# EAGLE board Lafferty1ab (EAGLE 6.6.0), part 1 of 3
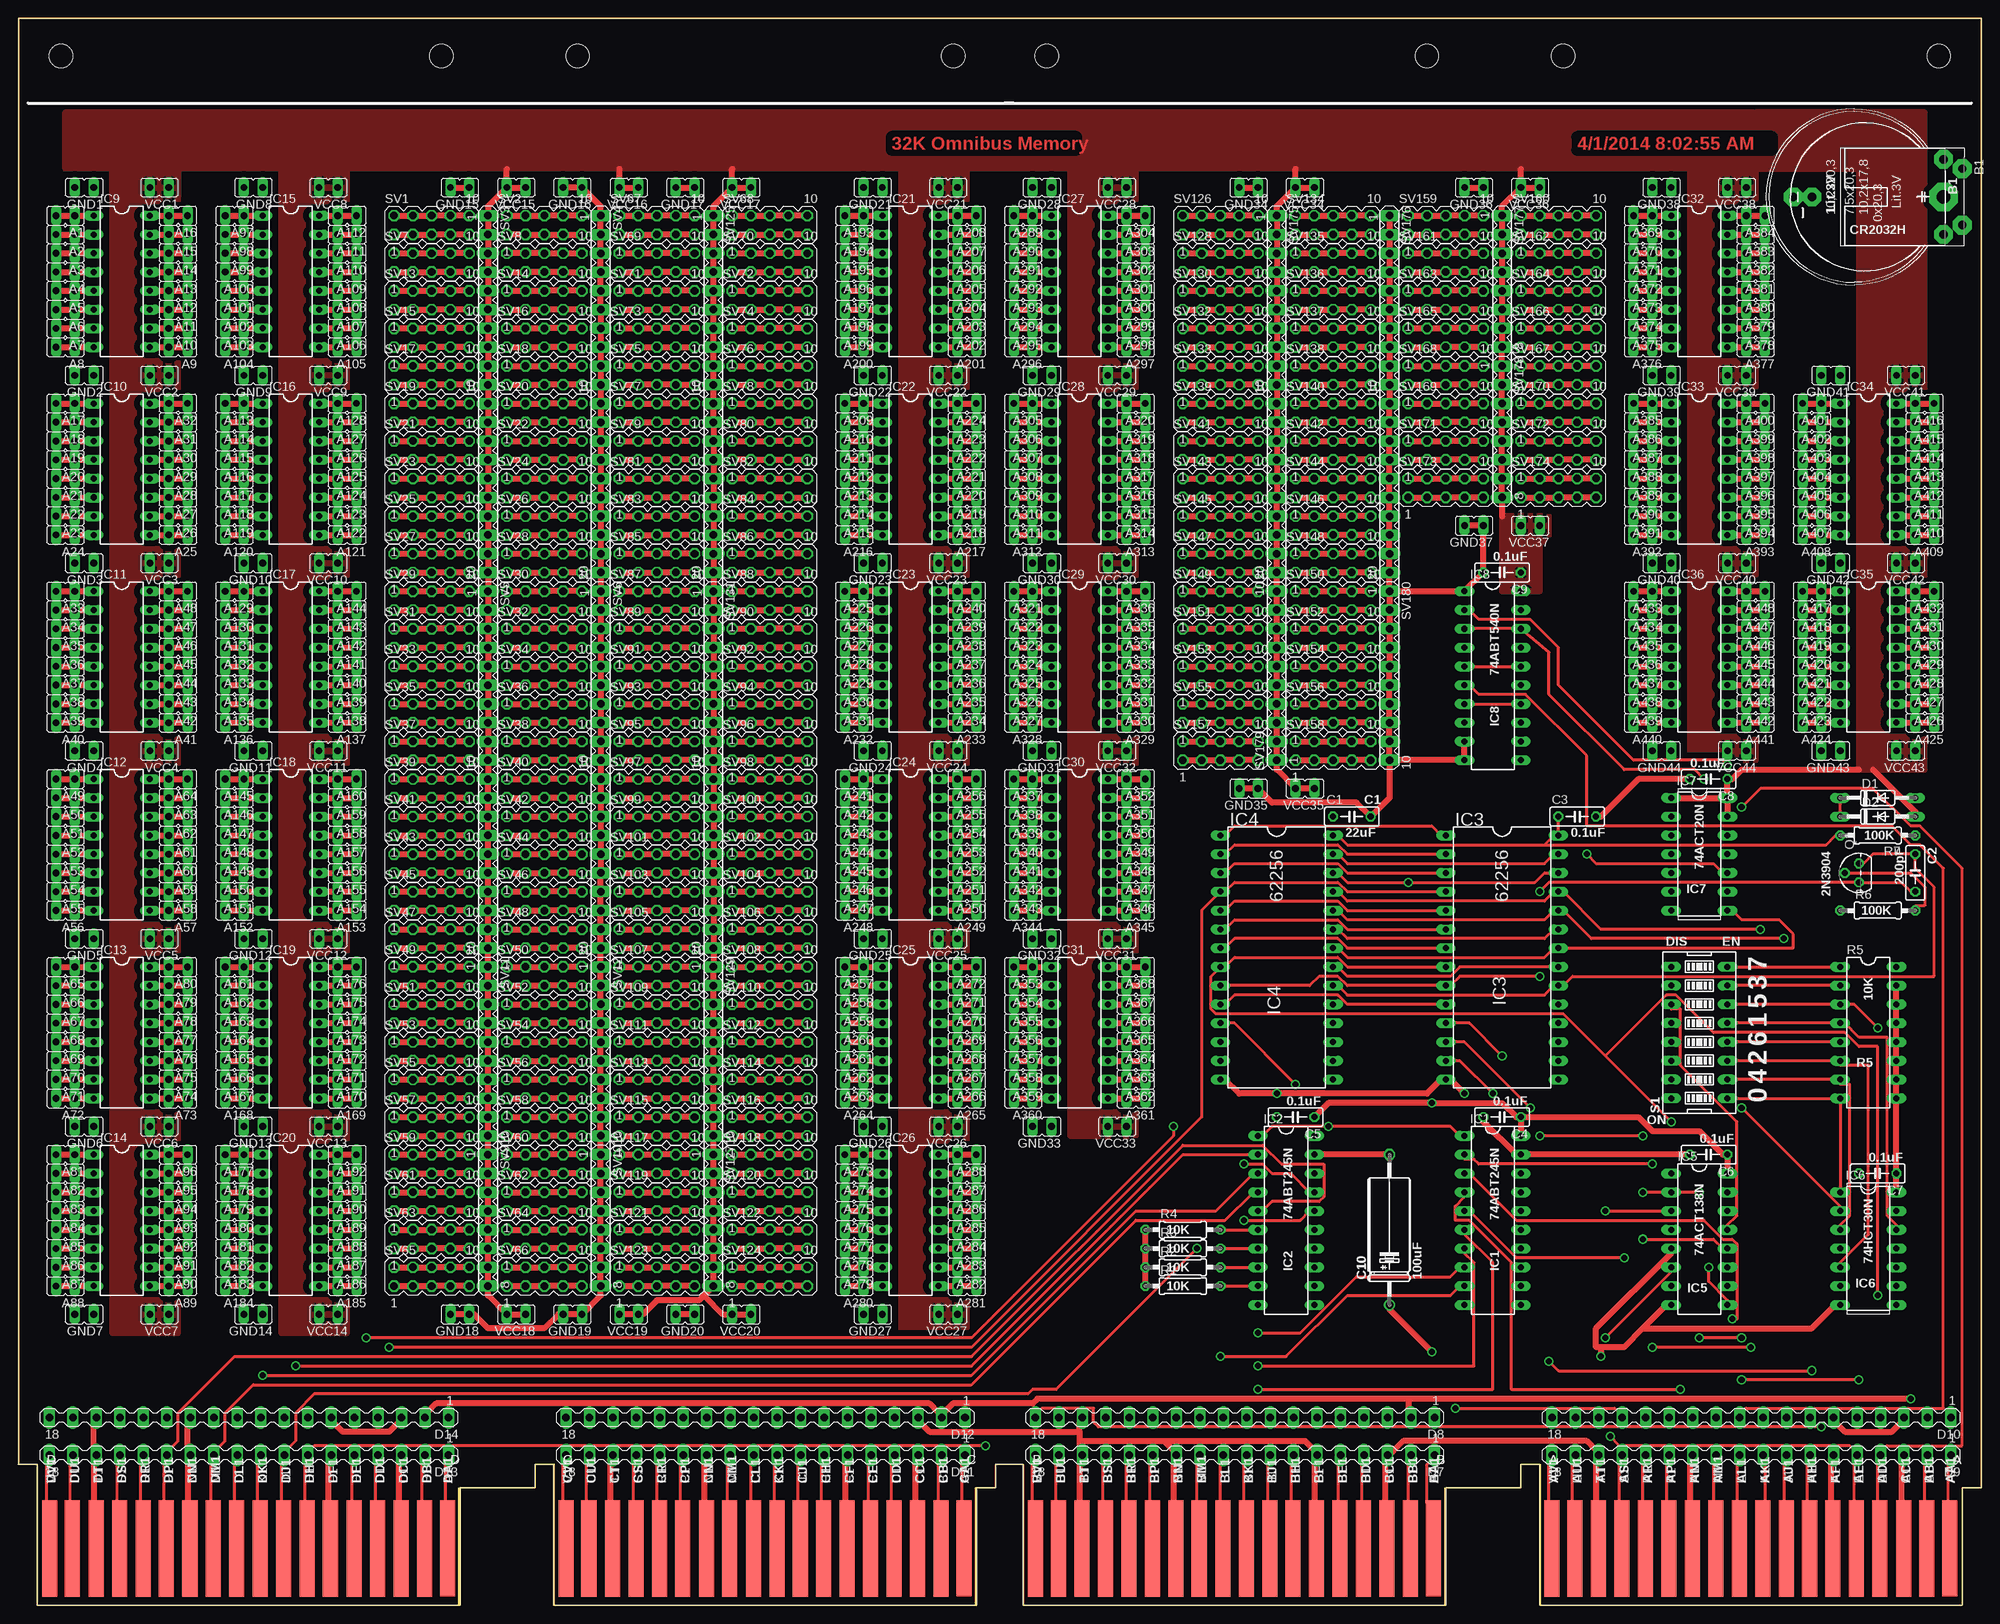
[diagram p5: board, top side]
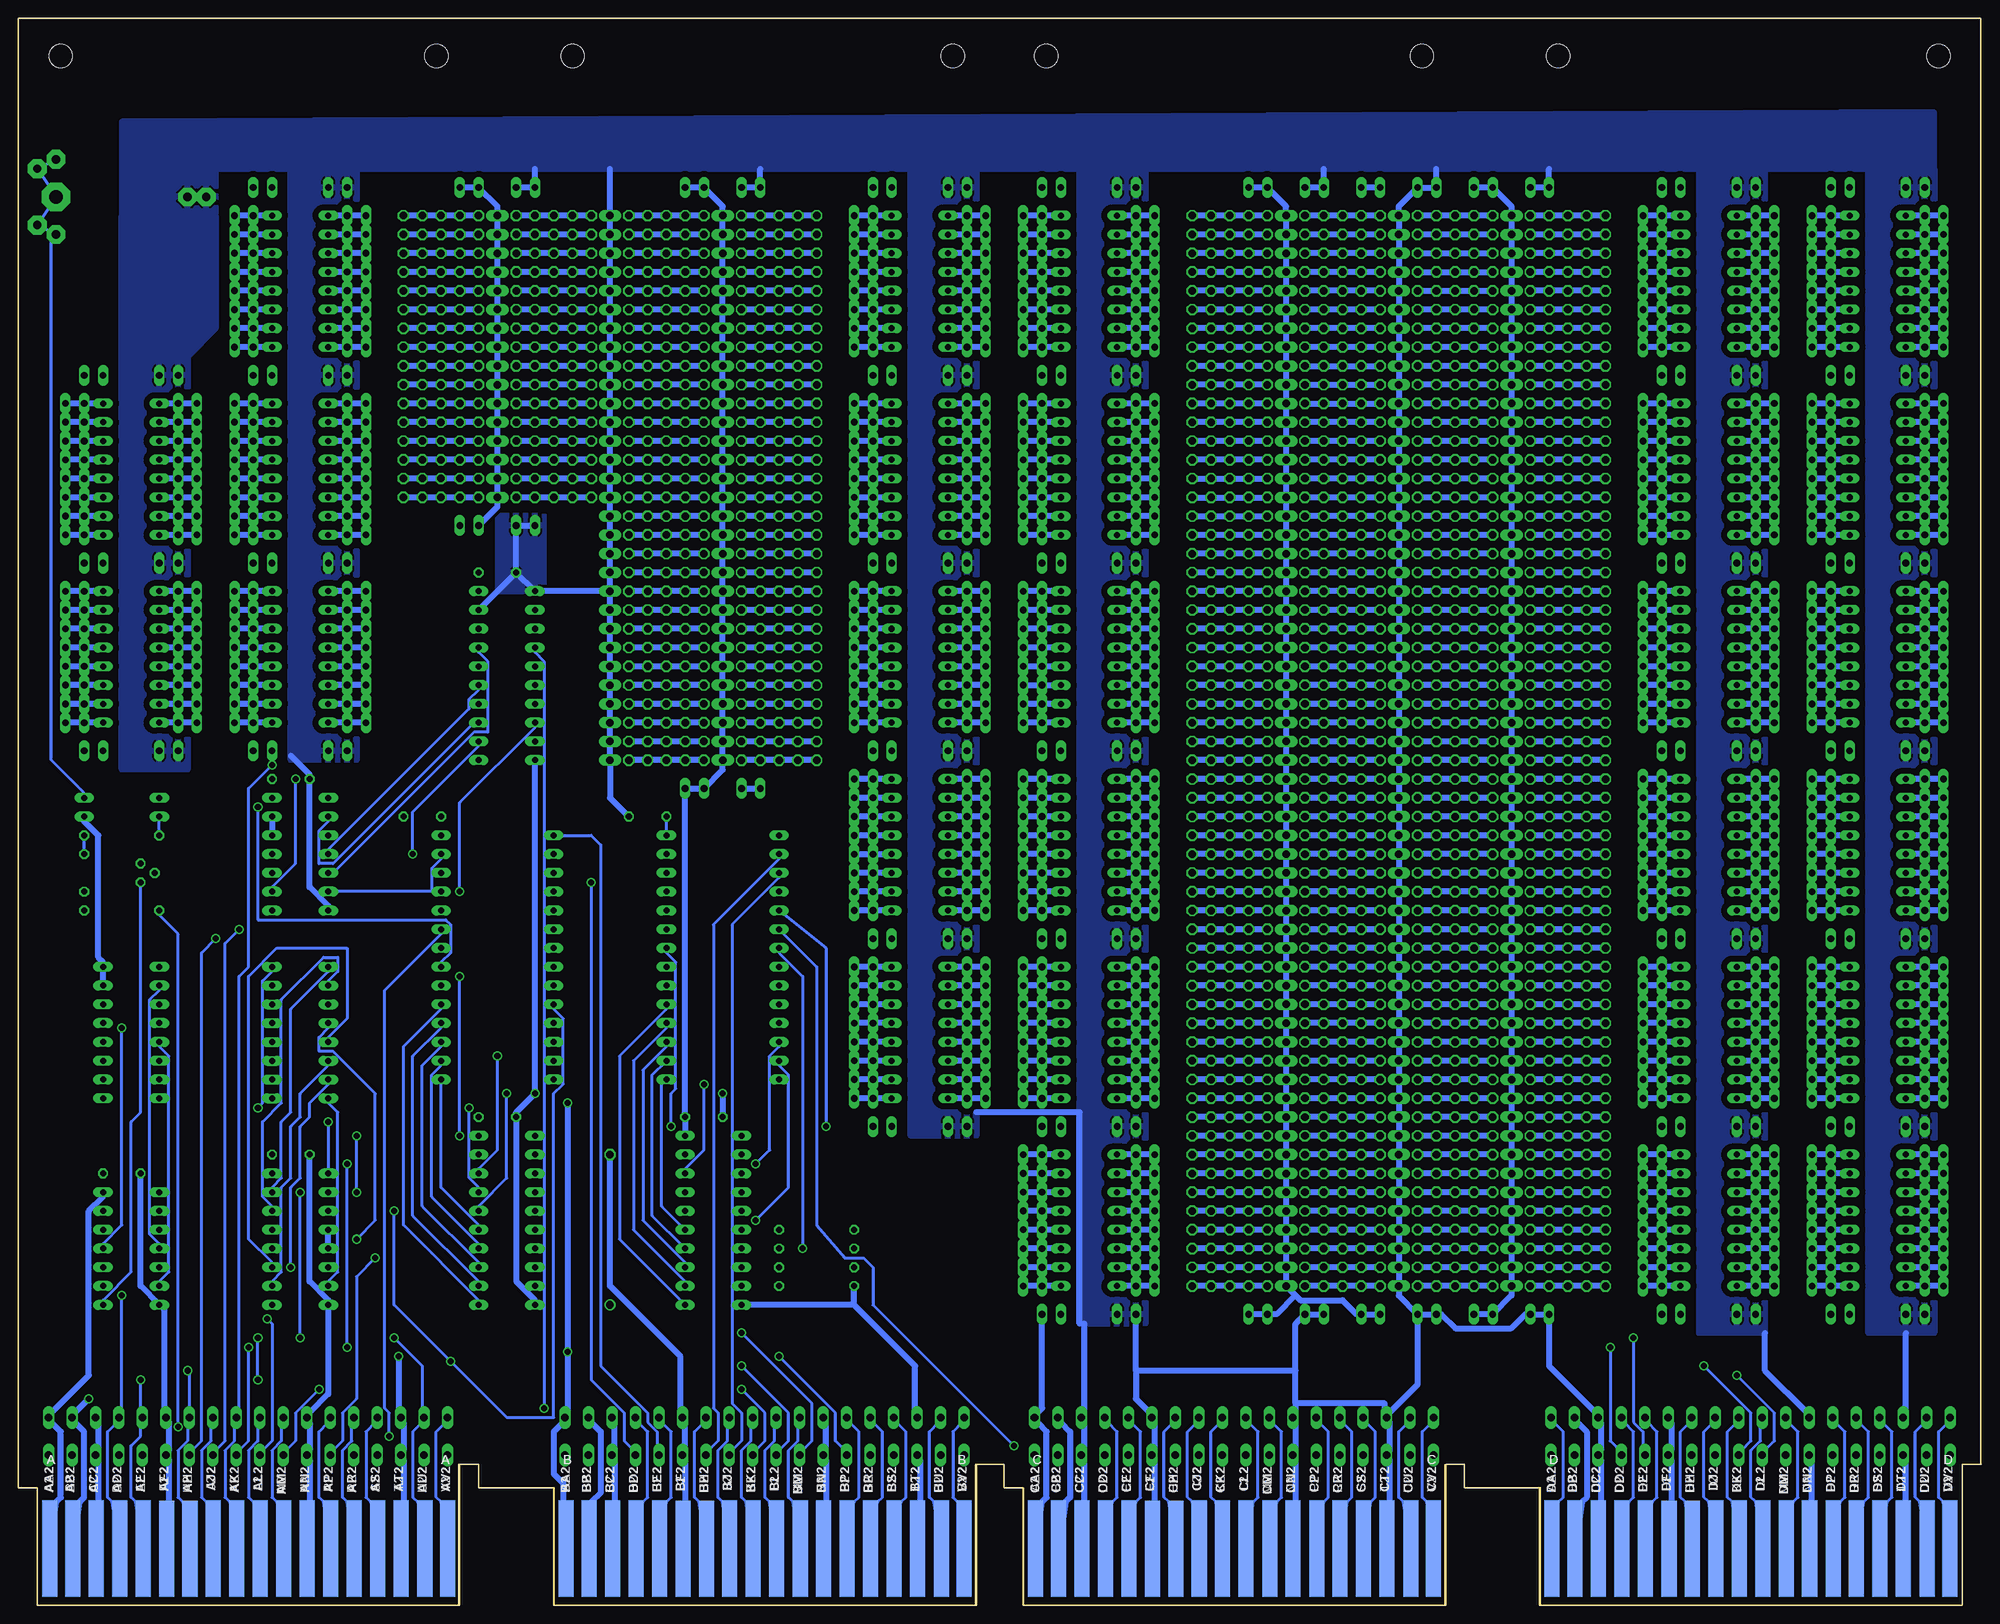
[diagram p6: board, bottom side, seen from below]

Size 265.43 x 214.63 mm. Coordinates in mm from the lower left corner, seen from the top.
Outline: 136.02,0 136.02,19.05 135.83,19.05
Outline: 129.41,0 129.41,15.88 129.6,15.88
Outline: 192.91,0 192.91,15.88 193.04,15.88
Outline: 205.87,0 205.87,19.05 205.74,19.05
Outline: 59.56,0 59.56,15.88 59.75,15.88
Outline: 72.52,0 72.52,19.05 72.39,19.05
Copper layers (1+16): Top 0.035mm / dielectric 1.5mm / Bottom 0.035mm
Design rules "16mils": minimum track width 16mil, minimum drill 32mil, track to track 15mil, track to pad 10mil, pad to pad 10mil, via to via 10mil, smd to smd 10mil, copper to edge 13mil, drill to drill 10mil, minimum pad ring 10mil, minimum via ring 8mil, stop-mask expansion 0mil, vias tented up to drill 0mil, thermal gap 10mil
Net classes: 1 supply: width 0.813 mm

## Footprints (pad centres in the part's own frame; a part is rotated, then mirrored left to right if it is on the bottom)
JP1 = drill 0.914 long: 1 0,-1.27; 2 0,1.27
B2430UNI = drill 1.118 pad 2.54 octagon: + 3.81,14.605; +@1 -3.81,14.605; +@2 -5.08,12.065; +@3 5.08,12.065; - 0,-5.715; -@1 0,-8.255 | drill 1.803 pad 3.81 octagon: +@4 0,12.065
C050-025X075 = drill 0.813 octagon: 1 -2.54,0; 2 2.54,0
E12-8 = drill 1.016: + -10.16,0 | drill 1.016 octagon: - 10.16,0
DO35-10 = drill 0.813 long: A 5.08,0; C -5.08,0
MA18-1 = drill 1.016 long: 1 -25.146,0; 2 -21.971,0; 3 -18.796,0; 4 -15.621,0; 5 -12.446,0; 6 -9.271,0; 7 -6.096,0; 8 -2.921,0; 9 0.254,0; 10 3.429,0; 11 6.604,0; 12 9.779,0; 13 12.954,0; 14 16.129,0; 15 19.304,0; 16 22.479,0; 17 25.654,0; 18 28.829,0
DIL20 = drill 0.813 long: 1 -11.43,-3.81; 2 -8.89,-3.81; 3 -6.35,-3.81; 4 -3.81,-3.81; 5 -1.27,-3.81; 6 1.27,-3.81; 7 3.81,-3.81; 8 6.35,-3.81; 9 8.89,-3.81; 10 11.43,-3.81; 11 11.43,3.81; 12 8.89,3.81; 13 6.35,3.81; 14 3.81,3.81; 15 1.27,3.81; 16 -1.27,3.81; 17 -3.81,3.81; 18 -6.35,3.81; 19 -8.89,3.81; 20 -11.43,3.81
DIL28-6 = drill 0.813 long: 1 -16.51,-7.62; 2 -13.97,-7.62; 3 -11.43,-7.62; 4 -8.89,-7.62; 5 -6.35,-7.62; 6 -3.81,-7.62; 7 -1.27,-7.62; 8 1.27,-7.62; 9 3.81,-7.62; 10 6.35,-7.62; 11 8.89,-7.62; 12 11.43,-7.62; 13 13.97,-7.62; 14 16.51,-7.62; 15 16.51,7.62; 16 13.97,7.62; 17 11.43,7.62; 18 8.89,7.62; 19 6.35,7.62; 20 3.81,7.62; 21 1.27,7.62; 22 -1.27,7.62; 23 -3.81,7.62; 24 -6.35,7.62; 25 -8.89,7.62; 26 -11.43,7.62; 27 -13.97,7.62; 28 -16.51,7.62
DIL16 = drill 0.813 long: 1 -8.89,-3.81; 2 -6.35,-3.81; 3 -3.81,-3.81; 4 -1.27,-3.81; 5 1.27,-3.81; 6 3.81,-3.81; 7 6.35,-3.81; 8 8.89,-3.81; 9 8.89,3.81; 10 6.35,3.81; 11 3.81,3.81; 12 1.27,3.81; 13 -1.27,3.81; 14 -3.81,3.81; 15 -6.35,3.81; 16 -8.89,3.81
DIL14 = drill 0.813 long: 1 -7.62,-3.81; 2 -5.08,-3.81; 3 -2.54,-3.81; 4 0,-3.81; 5 2.54,-3.81; 6 5.08,-3.81; 7 7.62,-3.81; 8 7.62,3.81; 9 5.08,3.81; 10 2.54,3.81; 11 0,3.81; 12 -2.54,3.81; 13 -5.08,3.81; 14 -7.62,3.81
TO92 = drill 0.813 octagon: 1 1.27,0; 2 0,1.905; 3 -1.27,0
0207/10 = drill 0.813 octagon: 1 -5.08,0; 2 5.08,0
EDG-08 = drill 0.813 long: 1 -8.89,-3.81; 2 -6.35,-3.81; 3 -3.81,-3.81; 4 -1.27,-3.81; 5 1.27,-3.81; 6 3.81,-3.81; 7 6.35,-3.81; 8 8.89,-3.81; 9 8.89,3.81; 10 6.35,3.81; 11 3.81,3.81; 12 1.27,3.81; 13 -1.27,3.81; 14 -3.81,3.81; 15 -6.35,3.81; 16 -8.89,3.81
MA05-2 = drill 1.016 octagon: 1 -5.08,-1.27; 2 -5.08,1.27; 3 -2.54,-1.27; 4 -2.54,1.27; 5 0,-1.27; 6 0,1.27; 7 2.54,-1.27; 8 2.54,1.27; 9 5.08,-1.27; 10 5.08,1.27
MA20-1 = drill 1.016 long: 1 -24.13,0; 2 -21.59,0; 3 -19.05,0; 4 -16.51,0; 5 -13.97,0; 6 -11.43,0; 7 -8.89,0; 8 -6.35,0; 9 -3.81,0; 10 -1.27,0; 11 1.27,0; 12 3.81,0; 13 6.35,0; 14 8.89,0; 15 11.43,0; 16 13.97,0; 17 16.51,0; 18 19.05,0; 19 21.59,0; 20 24.13,0
MA08-1 = drill 1.016 long: 1 -8.89,0; 2 -6.35,0; 3 -3.81,0; 4 -1.27,0; 5 1.27,0; 6 3.81,0; 7 6.35,0; 8 8.89,0
MA10-1 = drill 1.016 long: 1 -11.43,0; 2 -8.89,0; 3 -6.35,0; 4 -3.81,0; 5 -1.27,0; 6 1.27,0; 7 3.81,0; 8 6.35,0; 9 8.89,0; 10 11.43,0
OMNIBUS = hole 3.175: 208.915,209.55; 259.715,209.55; 190.5,209.55; 139.065,209.55; 75.616,209.55; 126.416,209.55; 57.201,209.55; 5.766,209.55
EDGE-CON8 = smd 2.032 x 13.017: AA1 261.223,7.709; AB1 258.118,7.684; AC1 254.956,7.684; AD1 251.765,7.684; AE1 248.59,7.693; AF1 245.389,7.668; AH1 242.24,7.668; AJ1 239.09,7.668; AK1 235.915,7.668; AL1 232.74,7.693; AM1 229.54,7.693; AN1 226.39,7.693; AP1 223.19,7.668; AR1 220.04,7.668; AS1 216.865,7.693; AT1 213.69,7.693; AU1 210.49,7.693; AV1 207.404,7.668; BA1 191.373,7.709; BB1 188.268,7.684; BC1 185.106,7.684; BD1 181.915,7.684; BE1 178.74,7.693; BF1 175.539,7.668; BH1 172.39,7.668; BJ1 169.24,7.668; BK1 166.065,7.668; BL1 162.89,7.693; BM1 159.69,7.693; BN1 156.54,7.693; BP1 153.34,7.668; BR1 150.19,7.668; BS1 147.015,7.693; BT1 143.84,7.693; BU1 140.64,7.693; BV1 137.554,7.668; CA1 127.873,7.709; CB1 124.768,7.684; CC1 121.606,7.684; CD1 118.415,7.684; CE1 115.24,7.693; CF1 112.039,7.668; CH1 108.89,7.668; CJ1 105.74,7.668; CK1 102.565,7.668; CL1 99.39,7.693; CM1 96.19,7.693; CN1 93.04,7.693; CP1 89.84,7.668; CR1 86.69,7.668; CS1 83.515,7.693; CT1 80.34,7.693; CU1 77.14,7.693; CV1 74.054,7.668; DA1 58.023,7.709; DB1 54.918,7.684; DC1 51.756,7.684; DD1 48.565,7.684; DE1 45.39,7.693; DF1 42.189,7.668; DH1 39.04,7.668; DJ1 35.89,7.668; DK1 32.715,7.668; DL1 29.54,7.693; DM1 26.34,7.693; DN1 23.19,7.693; DP1 19.99,7.668; DR1 16.84,7.668; DS1 13.665,7.693; DT1 10.49,7.693; DU1 7.29,7.693; DV1 4.204,7.668 | smd 2.032 x 13.017 bottom: AA2 261.223,7.69; AB2 258.102,7.668; AC2 254.94,7.668; AD2 251.765,7.693; AE2 248.59,7.693; AF2 245.389,7.642; AH2 242.24,7.642; AJ2 239.09,7.668; AK2 235.915,7.668; AL2 232.74,7.693; AM2 229.54,7.693; AN2 226.39,7.693; AP2 223.19,7.668; AR2 220.04,7.668; AS2 216.865,7.693; AT2 213.69,7.693; AU2 210.464,7.693; AV2 207.404,7.668; BA2 191.373,7.69; BB2 188.252,7.668; BC2 185.09,7.668; BD2 181.915,7.693; BE2 178.74,7.693; BF2 175.539,7.642; BH2 172.39,7.642; BJ2 169.24,7.668; BK2 166.065,7.668; BL2 162.89,7.693; BM2 159.69,7.693; BN2 156.54,7.693; BP2 153.34,7.668; BR2 150.19,7.668; BS2 147.015,7.693; BT2 143.84,7.693; BU2 140.614,7.693; BV2 137.554,7.668; CA2 127.873,7.69; CB2 124.752,7.668; CC2 121.59,7.668; CD2 118.415,7.693; CE2 115.24,7.693; CF2 112.039,7.642; CH2 108.89,7.642; CJ2 105.74,7.668; CK2 102.565,7.668; CL2 99.39,7.693; CM2 96.19,7.693; CN2 93.04,7.693; CP2 89.84,7.668; CR2 86.69,7.668; CS2 83.515,7.693; CT2 80.34,7.693; CU2 77.114,7.693; CV2 74.054,7.668; DA2 58.023,7.69; DB2 54.902,7.668; DC2 51.74,7.668; DD2 48.565,7.693; DE2 45.39,7.693; DF2 42.189,7.642; DH2 39.04,7.642; DJ2 35.89,7.668; DK2 32.715,7.668; DL2 29.54,7.693; DM2 26.34,7.693; DN2 23.19,7.693; DP2 19.99,7.668; DR2 16.84,7.668; DS2 13.665,7.693; DT2 10.49,7.693; DU2 7.264,7.693; DV2 4.204,7.668

## Placement (x,y rotation side)
A1  [JP1]  6.35,187.96 90 top
A2  [JP1]  6.35,185.42 90 top
A3  [JP1]  6.35,182.88 90 top
A4  [JP1]  6.35,180.34 90 top
A5  [JP1]  6.35,177.8 90 top
A6  [JP1]  6.35,175.26 90 top
A7  [JP1]  6.35,172.72 90 top
A8  [JP1]  6.35,170.18 90 top
A9  [JP1]  21.59,170.18 90 top
A10  [JP1]  21.59,172.72 90 top
A11  [JP1]  21.59,175.26 90 top
A12  [JP1]  21.59,177.8 90 top
A13  [JP1]  21.59,180.34 90 top
A14  [JP1]  21.59,182.88 90 top
A15  [JP1]  21.59,185.42 90 top
A16  [JP1]  21.59,187.96 90 top
A17  [JP1]  6.35,162.56 90 top
A18  [JP1]  6.35,160.02 90 top
A19  [JP1]  6.35,157.48 90 top
A20  [JP1]  6.35,154.94 90 top
A21  [JP1]  6.35,152.4 90 top
A22  [JP1]  6.35,149.86 90 top
A23  [JP1]  6.35,147.32 90 top
A24  [JP1]  6.35,144.78 90 top
A25  [JP1]  21.59,144.78 90 top
A26  [JP1]  21.59,147.32 90 top
A27  [JP1]  21.59,149.86 90 top
A28  [JP1]  21.59,152.4 90 top
A29  [JP1]  21.59,154.94 90 top
A30  [JP1]  21.59,157.48 90 top
A31  [JP1]  21.59,160.02 90 top
A32  [JP1]  21.59,162.56 90 top
A33  [JP1]  6.35,137.16 90 top
A34  [JP1]  6.35,134.62 90 top
A35  [JP1]  6.35,132.08 90 top
A36  [JP1]  6.35,129.54 90 top
A37  [JP1]  6.35,127 90 top
A38  [JP1]  6.35,124.46 90 top
A39  [JP1]  6.35,121.92 90 top
A40  [JP1]  6.35,119.38 90 top
A41  [JP1]  21.59,119.38 90 top
A42  [JP1]  21.59,121.92 90 top
A43  [JP1]  21.59,124.46 90 top
A44  [JP1]  21.59,127 90 top
A45  [JP1]  21.59,129.54 90 top
A46  [JP1]  21.59,132.08 90 top
A47  [JP1]  21.59,134.62 90 top
A48  [JP1]  21.59,137.16 90 top
A49  [JP1]  6.35,111.76 90 top
A50  [JP1]  6.35,109.22 90 top
A51  [JP1]  6.35,106.68 90 top
A52  [JP1]  6.35,104.14 90 top
A53  [JP1]  6.35,101.6 90 top
A54  [JP1]  6.35,99.06 90 top
A55  [JP1]  6.35,96.52 90 top
A56  [JP1]  6.35,93.98 90 top
A57  [JP1]  21.59,93.98 90 top
A58  [JP1]  21.59,96.52 90 top
A59  [JP1]  21.59,99.06 90 top
A60  [JP1]  21.59,101.6 90 top
A61  [JP1]  21.59,104.14 90 top
A62  [JP1]  21.59,106.68 90 top
A63  [JP1]  21.59,109.22 90 top
A64  [JP1]  21.59,111.76 90 top
A65  [JP1]  6.35,86.36 90 top
A66  [JP1]  6.35,83.82 90 top
A67  [JP1]  6.35,81.28 90 top
A68  [JP1]  6.35,78.74 90 top
A69  [JP1]  6.35,76.2 90 top
A70  [JP1]  6.35,73.66 90 top
A71  [JP1]  6.35,71.12 90 top
A72  [JP1]  6.35,68.58 90 top
A73  [JP1]  21.59,68.58 90 top
A74  [JP1]  21.59,71.12 90 top
A75  [JP1]  21.59,73.66 90 top
A76  [JP1]  21.59,76.2 90 top
A77  [JP1]  21.59,78.74 90 top
A78  [JP1]  21.59,81.28 90 top
A79  [JP1]  21.59,83.82 90 top
A80  [JP1]  21.59,86.36 90 top
A81  [JP1]  6.35,60.96 90 top
A82  [JP1]  6.35,58.42 90 top
A83  [JP1]  6.35,55.88 90 top
A84  [JP1]  6.35,53.34 90 top
A85  [JP1]  6.35,50.8 90 top
A86  [JP1]  6.35,48.26 90 top
A87  [JP1]  6.35,45.72 90 top
A88  [JP1]  6.35,43.18 90 top
A89  [JP1]  21.59,43.18 90 top
A90  [JP1]  21.59,45.72 90 top
A91  [JP1]  21.59,48.26 90 top
A92  [JP1]  21.59,50.8 90 top
A93  [JP1]  21.59,53.34 90 top
A94  [JP1]  21.59,55.88 90 top
A95  [JP1]  21.59,58.42 90 top
A96  [JP1]  21.59,60.96 90 top
A97  [JP1]  29.21,187.96 90 top
A98  [JP1]  29.21,185.42 90 top
A99  [JP1]  29.21,182.88 90 top
A100  [JP1]  29.21,180.34 90 top
A101  [JP1]  29.21,177.8 90 top
A102  [JP1]  29.21,175.26 90 top
A103  [JP1]  29.21,172.72 90 top
A104  [JP1]  29.21,170.18 90 top
A105  [JP1]  44.45,170.18 90 top
A106  [JP1]  44.45,172.72 90 top
A107  [JP1]  44.45,175.26 90 top
A108  [JP1]  44.45,177.8 90 top
A109  [JP1]  44.45,180.34 90 top
A110  [JP1]  44.45,182.88 90 top
A111  [JP1]  44.45,185.42 90 top
A112  [JP1]  44.45,187.96 90 top
A113  [JP1]  29.21,162.56 90 top
A114  [JP1]  29.21,160.02 90 top
A115  [JP1]  29.21,157.48 90 top
A116  [JP1]  29.21,154.94 90 top
A117  [JP1]  29.21,152.4 90 top
A118  [JP1]  29.21,149.86 90 top
A119  [JP1]  29.21,147.32 90 top
A120  [JP1]  29.21,144.78 90 top
A121  [JP1]  44.45,144.78 90 top
A122  [JP1]  44.45,147.32 90 top
A123  [JP1]  44.45,149.86 90 top
A124  [JP1]  44.45,152.4 90 top
A125  [JP1]  44.45,154.94 90 top
A126  [JP1]  44.45,157.48 90 top
A127  [JP1]  44.45,160.02 90 top
A128  [JP1]  44.45,162.56 90 top
A129  [JP1]  29.21,137.16 90 top
A130  [JP1]  29.21,134.62 90 top
A131  [JP1]  29.21,132.08 90 top
A132  [JP1]  29.21,129.54 90 top
A133  [JP1]  29.21,127 90 top
A134  [JP1]  29.21,124.46 90 top
A135  [JP1]  29.21,121.92 90 top
A136  [JP1]  29.21,119.38 90 top
A137  [JP1]  44.45,119.38 90 top
A138  [JP1]  44.45,121.92 90 top
A139  [JP1]  44.45,124.46 90 top
A140  [JP1]  44.45,127 90 top
A141  [JP1]  44.45,129.54 90 top
A142  [JP1]  44.45,132.08 90 top
A143  [JP1]  44.45,134.62 90 top
A144  [JP1]  44.45,137.16 90 top
A145  [JP1]  29.21,111.76 90 top
A146  [JP1]  29.21,109.22 90 top
A147  [JP1]  29.21,106.68 90 top
A148  [JP1]  29.21,104.14 90 top
A149  [JP1]  29.21,101.6 90 top
A150  [JP1]  29.21,99.06 90 top
A151  [JP1]  29.21,96.52 90 top
A152  [JP1]  29.21,93.98 90 top
A153  [JP1]  44.45,93.98 90 top
A154  [JP1]  44.45,96.52 90 top
A155  [JP1]  44.45,99.06 90 top
A156  [JP1]  44.45,101.6 90 top
A157  [JP1]  44.45,104.14 90 top
A158  [JP1]  44.45,106.68 90 top
A159  [JP1]  44.45,109.22 90 top
A160  [JP1]  44.45,111.76 90 top
A161  [JP1]  29.21,86.36 90 top
A162  [JP1]  29.21,83.82 90 top
A163  [JP1]  29.21,81.28 90 top
A164  [JP1]  29.21,78.74 90 top
A165  [JP1]  29.21,76.2 90 top
A166  [JP1]  29.21,73.66 90 top
A167  [JP1]  29.21,71.12 90 top
A168  [JP1]  29.21,68.58 90 top
A169  [JP1]  44.45,68.58 90 top
A170  [JP1]  44.45,71.12 90 top
A171  [JP1]  44.45,73.66 90 top
A172  [JP1]  44.45,76.2 90 top
A173  [JP1]  44.45,78.74 90 top
A174  [JP1]  44.45,81.28 90 top
A175  [JP1]  44.45,83.82 90 top
A176  [JP1]  44.45,86.36 90 top
A177  [JP1]  29.21,60.96 90 top
A178  [JP1]  29.21,58.42 90 top
A179  [JP1]  29.21,55.88 90 top
A180  [JP1]  29.21,53.34 90 top
A181  [JP1]  29.21,50.8 90 top
A182  [JP1]  29.21,48.26 90 top
A183  [JP1]  29.21,45.72 90 top
A184  [JP1]  29.21,43.18 90 top
A185  [JP1]  44.45,43.18 90 top
A186  [JP1]  44.45,45.72 90 top
A187  [JP1]  44.45,48.26 90 top
A188  [JP1]  44.45,50.8 90 top
A189  [JP1]  44.45,53.34 90 top
A190  [JP1]  44.45,55.88 90 top
A191  [JP1]  44.45,58.42 90 top
A192  [JP1]  44.45,60.96 90 top
A193  [JP1]  113.03,187.96 90 top
A194  [JP1]  113.03,185.42 90 top
A195  [JP1]  113.03,182.88 90 top
A196  [JP1]  113.03,180.34 90 top
A197  [JP1]  113.03,177.8 90 top
A198  [JP1]  113.03,175.26 90 top
A199  [JP1]  113.03,172.72 90 top
A200  [JP1]  113.03,170.18 90 top
A201  [JP1]  128.27,170.18 90 top
A202  [JP1]  128.27,172.72 90 top
A203  [JP1]  128.27,175.26 90 top
A204  [JP1]  128.27,177.8 90 top
A205  [JP1]  128.27,180.34 90 top
A206  [JP1]  128.27,182.88 90 top
A207  [JP1]  128.27,185.42 90 top
A208  [JP1]  128.27,187.96 90 top
A209  [JP1]  113.03,162.56 90 top
A210  [JP1]  113.03,160.02 90 top
A211  [JP1]  113.03,157.48 90 top
A212  [JP1]  113.03,154.94 90 top
A213  [JP1]  113.03,152.4 90 top
A214  [JP1]  113.03,149.86 90 top
A215  [JP1]  113.03,147.32 90 top
A216  [JP1]  113.03,144.78 90 top
A217  [JP1]  128.27,144.78 90 top
A218  [JP1]  128.27,147.32 90 top
A219  [JP1]  128.27,149.86 90 top
A220  [JP1]  128.27,152.4 90 top
A221  [JP1]  128.27,154.94 90 top
A222  [JP1]  128.27,157.48 90 top
A223  [JP1]  128.27,160.02 90 top
A224  [JP1]  128.27,162.56 90 top
A225  [JP1]  113.03,137.16 90 top
A226  [JP1]  113.03,134.62 90 top
A227  [JP1]  113.03,132.08 90 top
A228  [JP1]  113.03,129.54 90 top
A229  [JP1]  113.03,127 90 top
A230  [JP1]  113.03,124.46 90 top
A231  [JP1]  113.03,121.92 90 top
A232  [JP1]  113.03,119.38 90 top
A233  [JP1]  128.27,119.38 90 top
A234  [JP1]  128.27,121.92 90 top
A235  [JP1]  128.27,124.46 90 top
A236  [JP1]  128.27,127 90 top
A237  [JP1]  128.27,129.54 90 top
A238  [JP1]  128.27,132.08 90 top
A239  [JP1]  128.27,134.62 90 top
A240  [JP1]  128.27,137.16 90 top
A241  [JP1]  113.03,111.76 90 top
A242  [JP1]  113.03,109.22 90 top
A243  [JP1]  113.03,106.68 90 top
A244  [JP1]  113.03,104.14 90 top
A245  [JP1]  113.03,101.6 90 top
A246  [JP1]  113.03,99.06 90 top
A247  [JP1]  113.03,96.52 90 top
A248  [JP1]  113.03,93.98 90 top
A249  [JP1]  128.27,93.98 90 top
A250  [JP1]  128.27,96.52 90 top
A251  [JP1]  128.27,99.06 90 top
A252  [JP1]  128.27,101.6 90 top
A253  [JP1]  128.27,104.14 90 top
A254  [JP1]  128.27,106.68 90 top
A255  [JP1]  128.27,109.22 90 top
A256  [JP1]  128.27,111.76 90 top
A257  [JP1]  113.03,86.36 90 top
A258  [JP1]  113.03,83.82 90 top
A259  [JP1]  113.03,81.28 90 top
A260  [JP1]  113.03,78.74 90 top
A261  [JP1]  113.03,76.2 90 top
A262  [JP1]  113.03,73.66 90 top
A263  [JP1]  113.03,71.12 90 top
A264  [JP1]  113.03,68.58 90 top
A265  [JP1]  128.27,68.58 90 top
A266  [JP1]  128.27,71.12 90 top
A267  [JP1]  128.27,73.66 90 top
A268  [JP1]  128.27,76.2 90 top
A269  [JP1]  128.27,78.74 90 top
A270  [JP1]  128.27,81.28 90 top
A271  [JP1]  128.27,83.82 90 top
A272  [JP1]  128.27,86.36 90 top
A273  [JP1]  113.03,60.96 90 top
A274  [JP1]  113.03,58.42 90 top
A275  [JP1]  113.03,55.88 90 top
A276  [JP1]  113.03,53.34 90 top
A277  [JP1]  113.03,50.8 90 top
A278  [JP1]  113.03,48.26 90 top
A279  [JP1]  113.03,45.72 90 top
A280  [JP1]  113.03,43.18 90 top
A281  [JP1]  128.27,43.18 90 top
A282  [JP1]  128.27,45.72 90 top
A283  [JP1]  128.27,48.26 90 top
A284  [JP1]  128.27,50.8 90 top
A285  [JP1]  128.27,53.34 90 top
A286  [JP1]  128.27,55.88 90 top
A287  [JP1]  128.27,58.42 90 top
A288  [JP1]  128.27,60.96 90 top
A289  [JP1]  135.89,187.96 90 top
A290  [JP1]  135.89,185.42 90 top
A291  [JP1]  135.89,182.88 90 top
A292  [JP1]  135.89,180.34 90 top
A293  [JP1]  135.89,177.8 90 top
A294  [JP1]  135.89,175.26 90 top
A295  [JP1]  135.89,172.72 90 top
A296  [JP1]  135.89,170.18 90 top
A297  [JP1]  151.13,170.18 90 top
A298  [JP1]  151.13,172.72 90 top
A299  [JP1]  151.13,175.26 90 top
A300  [JP1]  151.13,177.8 90 top
A301  [JP1]  151.13,180.34 90 top
A302  [JP1]  151.13,182.88 90 top
A303  [JP1]  151.13,185.42 90 top
A304  [JP1]  151.13,187.96 90 top
A305  [JP1]  135.89,162.56 90 top
A306  [JP1]  135.89,160.02 90 top
A307  [JP1]  135.89,157.48 90 top
A308  [JP1]  135.89,154.94 90 top
A309  [JP1]  135.89,152.4 90 top
A310  [JP1]  135.89,149.86 90 top
A311  [JP1]  135.89,147.32 90 top
A312  [JP1]  135.89,144.78 90 top
A313  [JP1]  151.13,144.78 90 top
A314  [JP1]  151.13,147.32 90 top
A315  [JP1]  151.13,149.86 90 top
A316  [JP1]  151.13,152.4 90 top
A317  [JP1]  151.13,154.94 90 top
A318  [JP1]  151.13,157.48 90 top
A319  [JP1]  151.13,160.02 90 top
A320  [JP1]  151.13,162.56 90 top
A321  [JP1]  135.89,137.16 90 top
A322  [JP1]  135.89,134.62 90 top
A323  [JP1]  135.89,132.08 90 top
A324  [JP1]  135.89,129.54 90 top
A325  [JP1]  135.89,127 90 top
A326  [JP1]  135.89,124.46 90 top
A327  [JP1]  135.89,121.92 90 top
A328  [JP1]  135.89,119.38 90 top
A329  [JP1]  151.13,119.38 90 top
A330  [JP1]  151.13,121.92 90 top
A331  [JP1]  151.13,124.46 90 top
A332  [JP1]  151.13,127 90 top
A333  [JP1]  151.13,129.54 90 top
A334  [JP1]  151.13,132.08 90 top
A335  [JP1]  151.13,134.62 90 top
A336  [JP1]  151.13,137.16 90 top
A337  [JP1]  135.89,111.76 90 top
A338  [JP1]  135.89,109.22 90 top
A339  [JP1]  135.89,106.68 90 top
A340  [JP1]  135.89,104.14 90 top
A341  [JP1]  135.89,101.6 90 top
A342  [JP1]  135.89,99.06 90 top
A343  [JP1]  135.89,96.52 90 top
A344  [JP1]  135.89,93.98 90 top
A345  [JP1]  151.13,93.98 90 top
A346  [JP1]  151.13,96.52 90 top
A347  [JP1]  151.13,99.06 90 top
A348  [JP1]  151.13,101.6 90 top
A349  [JP1]  151.13,104.14 90 top
A350  [JP1]  151.13,106.68 90 top
A351  [JP1]  151.13,109.22 90 top
A352  [JP1]  151.13,111.76 90 top
A353  [JP1]  135.89,86.36 90 top
A354  [JP1]  135.89,83.82 90 top
A355  [JP1]  135.89,81.28 90 top
A356  [JP1]  135.89,78.74 90 top
A357  [JP1]  135.89,76.2 90 top
A358  [JP1]  135.89,73.66 90 top
A359  [JP1]  135.89,71.12 90 top
A360  [JP1]  135.89,68.58 90 top
A361  [JP1]  151.13,68.58 90 top
A362  [JP1]  151.13,71.12 90 top
A363  [JP1]  151.13,73.66 90 top
A364  [JP1]  151.13,76.2 90 top
A365  [JP1]  151.13,78.74 90 top
A366  [JP1]  151.13,81.28 90 top
A367  [JP1]  151.13,83.82 90 top
A368  [JP1]  151.13,86.36 90 top
A369  [JP1]  219.71,187.96 90 top
A370  [JP1]  219.71,185.42 90 top
A371  [JP1]  219.71,182.88 90 top
A372  [JP1]  219.71,180.34 90 top
A373  [JP1]  219.71,177.8 90 top
A374  [JP1]  219.71,175.26 90 top
A375  [JP1]  219.71,172.72 90 top
A376  [JP1]  219.71,170.18 90 top
A377  [JP1]  234.95,170.18 90 top
A378  [JP1]  234.95,172.72 90 top
A379  [JP1]  234.95,175.26 90 top
A380  [JP1]  234.95,177.8 90 top
A381  [JP1]  234.95,180.34 90 top
A382  [JP1]  234.95,182.88 90 top
A383  [JP1]  234.95,185.42 90 top
A384  [JP1]  234.95,187.96 90 top
A385  [JP1]  219.71,162.56 90 top
A386  [JP1]  219.71,160.02 90 top
A387  [JP1]  219.71,157.48 90 top
A388  [JP1]  219.71,154.94 90 top
A389  [JP1]  219.71,152.4 90 top
A390  [JP1]  219.71,149.86 90 top
A391  [JP1]  219.71,147.32 90 top
A392  [JP1]  219.71,144.78 90 top
A393  [JP1]  234.95,144.78 90 top
A394  [JP1]  234.95,147.32 90 top
A395  [JP1]  234.95,149.86 90 top
A396  [JP1]  234.95,152.4 90 top
A397  [JP1]  234.95,154.94 90 top
A398  [JP1]  234.95,157.48 90 top
A399  [JP1]  234.95,160.02 90 top
A400  [JP1]  234.95,162.56 90 top
A401  [JP1]  242.57,162.56 90 top
A402  [JP1]  242.57,160.02 90 top
A403  [JP1]  242.57,157.48 90 top
A404  [JP1]  242.57,154.94 90 top
A405  [JP1]  242.57,152.4 90 top
A406  [JP1]  242.57,149.86 90 top
A407  [JP1]  242.57,147.32 90 top
A408  [JP1]  242.57,144.78 90 top
A409  [JP1]  257.81,144.78 90 top
A410  [JP1]  257.81,147.32 90 top
A411  [JP1]  257.81,149.86 90 top
A412  [JP1]  257.81,152.4 90 top
A413  [JP1]  257.81,154.94 90 top
A414  [JP1]  257.81,157.48 90 top
A415  [JP1]  257.81,160.02 90 top
A416  [JP1]  257.81,162.56 90 top
A417  [JP1]  242.57,137.16 90 top
A418  [JP1]  242.57,134.62 90 top
A419  [JP1]  242.57,132.08 90 top
A420  [JP1]  242.57,129.54 90 top
A421  [JP1]  242.57,127 90 top
A422  [JP1]  242.57,124.46 90 top
A423  [JP1]  242.57,121.92 90 top
A424  [JP1]  242.57,119.38 90 top
A425  [JP1]  257.81,119.38 90 top
A426  [JP1]  257.81,121.92 90 top
A427  [JP1]  257.81,124.46 90 top
A428  [JP1]  257.81,127 90 top
A429  [JP1]  257.81,129.54 90 top
A430  [JP1]  257.81,132.08 90 top
A431  [JP1]  257.81,134.62 90 top
A432  [JP1]  257.81,137.16 90 top
A433  [JP1]  219.71,137.16 90 top
A434  [JP1]  219.71,134.62 90 top
A435  [JP1]  219.71,132.08 90 top
A436  [JP1]  219.71,129.54 90 top
A437  [JP1]  219.71,127 90 top
A438  [JP1]  219.71,124.46 90 top
A439  [JP1]  219.71,121.92 90 top
A440  [JP1]  219.71,119.38 90 top
A441  [JP1]  234.95,119.38 90 top
A442  [JP1]  234.95,121.92 90 top
A443  [JP1]  234.95,124.46 90 top
A444  [JP1]  234.95,127 90 top
A445  [JP1]  234.95,129.54 90 top
A446  [JP1]  234.95,132.08 90 top
A447  [JP1]  234.95,134.62 90 top
A448  [JP1]  234.95,137.16 90 top
B1  CR2032  [B2430UNI]  248.28,190.5 270 top
C1  22uF  [C050-025X075]  180.34,106.68 0 top
C2  200pF  [C050-025X075]  256.54,99.06 270 top
C3  0.1uF  [C050-025X075]  210.82,106.68 0 top
C4  0.1uF  [C050-025X075]  200.66,66.04 180 top
C5  0.1uF  [C050-025X075]  172.72,66.04 180 top
C6  0.1uF  [C050-025X075]  228.6,60.96 180 top
C7  0.1uF  [C050-025X075]  251.46,58.42 180 top
C8  0.1uF  [C050-025X075]  228.6,111.76 180 top
C9  0.1uF  [C050-025X075]  200.66,139.7 180 top
C10  100uF  [E12-8]  185.42,50.8 90 top
D1  [DO35-10]  251.46,109.22 0 top
D2  [DO35-10]  251.46,106.68 0 top
D7  MA18-1  [MA18-1]  166.37,20.32 180 top
D8  MA18-1  [MA18-1]  166.37,25.4 180 top
D9  MA18-1  [MA18-1]  236.22,20.32 180 top
D10  MA18-1  [MA18-1]  236.22,25.4 180 top
D11  MA18-1  [MA18-1]  102.87,20.32 180 top
D12  MA18-1  [MA18-1]  102.87,25.4 180 top
D13  MA18-1  [MA18-1]  33.02,20.32 180 top
D14  MA18-1  [MA18-1]  33.02,25.4 180 top
GND1  [JP1]  8.89,191.77 90 top
GND2  [JP1]  8.89,166.37 90 top
GND3  [JP1]  8.89,140.97 90 top
GND4  [JP1]  8.89,115.57 90 top
GND5  [JP1]  8.89,90.17 90 top
GND6  [JP1]  8.89,64.77 90 top
GND7  [JP1]  8.89,39.37 90 top
GND8  [JP1]  31.75,191.77 90 top
GND9  [JP1]  31.75,166.37 90 top
GND10  [JP1]  31.75,140.97 90 top
GND11  [JP1]  31.75,115.57 90 top
GND12  [JP1]  31.75,90.17 90 top
GND13  [JP1]  31.75,64.77 90 top
GND14  [JP1]  31.75,39.37 90 top
GND15  [JP1]  59.69,191.77 90 top
GND16  [JP1]  74.93,191.77 90 top
GND17  [JP1]  90.17,191.77 90 top
GND18  [JP1]  59.69,39.37 90 top
GND19  [JP1]  74.93,39.37 90 top
GND20  [JP1]  90.17,39.37 90 top
GND21  [JP1]  115.57,191.77 90 top
GND22  [JP1]  115.57,166.37 90 top
GND23  [JP1]  115.57,140.97 90 top
GND24  [JP1]  115.57,115.57 90 top
GND25  [JP1]  115.57,90.17 90 top
GND26  [JP1]  115.57,64.77 90 top
GND27  [JP1]  115.57,39.37 90 top
GND28  [JP1]  138.43,191.77 90 top
GND29  [JP1]  138.43,166.37 90 top
GND30  [JP1]  138.43,140.97 90 top
GND31  [JP1]  138.43,115.57 90 top
GND32  [JP1]  138.43,90.17 90 top
GND33  [JP1]  138.43,64.77 90 top
GND34  [JP1]  166.37,191.77 90 top
GND35  [JP1]  166.37,110.49 90 top
GND36  [JP1]  196.85,191.77 90 top
GND37  [JP1]  196.85,146.05 90 top
GND38  [JP1]  222.25,191.77 90 top
GND39  [JP1]  222.25,166.37 90 top
GND40  [JP1]  222.25,140.97 90 top
GND41  [JP1]  245.11,166.37 90 top
GND42  [JP1]  245.11,140.97 90 top
GND43  [JP1]  245.11,115.57 90 top
GND44  [JP1]  222.25,115.57 90 top
IC1  74ALS245AN  [DIL20]  199.39,52.07 270 top
IC2  74ALS245AN  [DIL20]  171.45,52.07 270 top
IC3  62256  [DIL28-6]  200.66,87.63 270 top
IC4  62256  [DIL28-6]  170.18,87.63 270 top
IC5  74ACT138N  [DIL16]  227.33,49.53 270 top
IC6  74HCT30N  [DIL14]  250.19,48.26 270 top
IC7  74ACT20N  [DIL14]  227.33,101.6 270 top
IC8  74LS540N  [DIL20]  199.39,125.73 270 top
IC9  [DIL16]  13.97,179.07 270 top
IC10  [DIL16]  13.97,153.67 270 top
IC11  [DIL16]  13.97,128.27 270 top
IC12  [DIL16]  13.97,102.87 270 top
IC13  [DIL16]  13.97,77.47 270 top
IC14  [DIL16]  13.97,52.07 270 top
IC15  [DIL16]  36.83,179.07 270 top
IC16  [DIL16]  36.83,153.67 270 top
IC17  [DIL16]  36.83,128.27 270 top
IC18  [DIL16]  36.83,102.87 270 top
IC19  [DIL16]  36.83,77.47 270 top
IC20  [DIL16]  36.83,52.07 270 top
IC21  [DIL16]  120.65,179.07 270 top
IC22  [DIL16]  120.65,153.67 270 top
IC23  [DIL16]  120.65,128.27 270 top
IC24  [DIL16]  120.65,102.87 270 top
IC25  [DIL16]  120.65,77.47 270 top
IC26  [DIL16]  120.65,52.07 270 top
IC27  [DIL16]  143.51,179.07 270 top
IC28  [DIL16]  143.51,153.67 270 top
IC29  [DIL16]  143.51,128.27 270 top
IC30  [DIL16]  143.51,102.87 270 top
IC31  [DIL16]  143.51,77.47 270 top
IC32  [DIL16]  227.33,179.07 270 top
IC33  [DIL16]  227.33,153.67 270 top
IC34  [DIL16]  250.19,153.67 270 top
IC35  [DIL16]  250.19,128.27 270 top
IC36  [DIL16]  227.33,128.27 270 top
Q1  2N3904  [TO92]  248.92,99.06 90 top
R1  10K  [0207/10]  157.48,43.18 0 top
R2  10K  [0207/10]  157.48,45.72 0 top
R3  10K  [0207/10]  157.48,48.26 0 top
R4  10K  [0207/10]  157.48,50.8 0 top
R5  10K  [DIL16]  250.19,77.47 270 top
R6  100K  [0207/10]  251.46,93.98 0 top
R7  100K  [0207/10]  251.46,104.14 180 top
S1  [EDG-08]  227.33,77.47 90 top
SV1  [MA05-2]  55.88,186.69 0 top
SV2  [MA05-2]  71.12,186.69 0 top
SV3  [MA20-1]  63.5,163.83 270 top
SV4  [MA20-1]  78.74,163.83 270 top
SV5  [MA20-1]  63.5,113.03 270 top
SV6  [MA20-1]  78.74,113.03 270 top
SV7  [MA05-2]  55.88,181.61 0 top
SV8  [MA05-2]  71.12,181.61 0 top
SV9  [MA08-1]  63.5,52.07 270 top
SV10  [MA08-1]  78.74,52.07 270 top
SV11  [MA10-1]  63.5,74.93 270 top
SV12  [MA10-1]  78.74,74.93 270 top
SV13  [MA05-2]  55.88,176.53 0 top
SV14  [MA05-2]  71.12,176.53 0 top
SV15  [MA05-2]  55.88,171.45 0 top
SV16  [MA05-2]  71.12,171.45 0 top
SV17  [MA05-2]  55.88,166.37 0 top
SV18  [MA05-2]  71.12,166.37 0 top
SV19  [MA05-2]  55.88,161.29 0 top
SV20  [MA05-2]  71.12,161.29 0 top
SV21  [MA05-2]  55.88,156.21 0 top
SV22  [MA05-2]  71.12,156.21 0 top
SV23  [MA05-2]  55.88,151.13 0 top
SV24  [MA05-2]  71.12,151.13 0 top
SV25  [MA05-2]  55.88,146.05 0 top
SV26  [MA05-2]  71.12,146.05 0 top
SV27  [MA05-2]  55.88,140.97 0 top
SV28  [MA05-2]  71.12,140.97 0 top
SV29  [MA05-2]  55.88,135.89 0 top
SV30  [MA05-2]  71.12,135.89 0 top
SV31  [MA05-2]  55.88,130.81 0 top
SV32  [MA05-2]  71.12,130.81 0 top
SV33  [MA05-2]  55.88,125.73 0 top
SV34  [MA05-2]  71.12,125.73 0 top
SV35  [MA05-2]  55.88,120.65 0 top
SV36  [MA05-2]  71.12,120.65 0 top
SV37  [MA05-2]  55.88,115.57 0 top
SV38  [MA05-2]  71.12,115.57 0 top
SV39  [MA05-2]  55.88,110.49 0 top
SV40  [MA05-2]  71.12,110.49 0 top
SV41  [MA05-2]  55.88,105.41 0 top
SV42  [MA05-2]  71.12,105.41 0 top
SV43  [MA05-2]  55.88,100.33 0 top
SV44  [MA05-2]  71.12,100.33 0 top
SV45  [MA05-2]  55.88,95.25 0 top
SV46  [MA05-2]  71.12,95.25 0 top
SV47  [MA05-2]  55.88,90.17 0 top
SV48  [MA05-2]  71.12,90.17 0 top
SV49  [MA05-2]  55.88,85.09 0 top
SV50  [MA05-2]  71.12,85.09 0 top
SV51  [MA05-2]  55.88,80.01 0 top
SV52  [MA05-2]  71.12,80.01 0 top
SV53  [MA05-2]  55.88,74.93 0 top
SV54  [MA05-2]  71.12,74.93 0 top
SV55  [MA05-2]  55.88,69.85 0 top
SV56  [MA05-2]  71.12,69.85 0 top
SV57  [MA05-2]  55.88,64.77 0 top
SV58  [MA05-2]  71.12,64.77 0 top
SV59  [MA05-2]  55.88,59.69 0 top
SV60  [MA05-2]  71.12,59.69 0 top
SV61  [MA05-2]  55.88,54.61 0 top
SV62  [MA05-2]  71.12,54.61 0 top
SV63  [MA05-2]  55.88,49.53 0 top
SV64  [MA05-2]  71.12,49.53 0 top
SV65  [MA05-2]  55.88,44.45 0 top
SV66  [MA05-2]  71.12,44.45 0 top
SV67  [MA05-2]  86.36,186.69 0 top
SV68  [MA05-2]  101.6,186.69 0 top
SV69  [MA05-2]  86.36,181.61 0 top
SV70  [MA05-2]  101.6,181.61 0 top
SV71  [MA05-2]  86.36,176.53 0 top
SV72  [MA05-2]  101.6,176.53 0 top
SV73  [MA05-2]  86.36,171.45 0 top
SV74  [MA05-2]  101.6,171.45 0 top
SV75  [MA05-2]  86.36,166.37 0 top
SV76  [MA05-2]  101.6,166.37 0 top
SV77  [MA05-2]  86.36,161.29 0 top
SV78  [MA05-2]  101.6,161.29 0 top
SV79  [MA05-2]  86.36,156.21 0 top
SV80  [MA05-2]  101.6,156.21 0 top
SV81  [MA05-2]  86.36,151.13 0 top
SV82  [MA05-2]  101.6,151.13 0 top
SV83  [MA05-2]  86.36,146.05 0 top
SV84  [MA05-2]  101.6,146.05 0 top
SV85  [MA05-2]  86.36,140.97 0 top
SV86  [MA05-2]  101.6,140.97 0 top
SV87  [MA05-2]  86.36,135.89 0 top
SV88  [MA05-2]  101.6,135.89 0 top
SV89  [MA05-2]  86.36,130.81 0 top
SV90  [MA05-2]  101.6,130.81 0 top
SV91  [MA05-2]  86.36,125.73 0 top
SV92  [MA05-2]  101.6,125.73 0 top
SV93  [MA05-2]  86.36,120.65 0 top
SV94  [MA05-2]  101.6,120.65 0 top
SV95  [MA05-2]  86.36,115.57 0 top
SV96  [MA05-2]  101.6,115.57 0 top
SV97  [MA05-2]  86.36,110.49 0 top
SV98  [MA05-2]  101.6,110.49 0 top
SV99  [MA05-2]  86.36,105.41 0 top
SV100  [MA05-2]  101.6,105.41 0 top
SV101  [MA05-2]  86.36,100.33 0 top
SV102  [MA05-2]  101.6,100.33 0 top
SV103  [MA05-2]  86.36,95.25 0 top
SV104  [MA05-2]  101.6,95.25 0 top
SV105  [MA05-2]  86.36,90.17 0 top
SV106  [MA05-2]  101.6,90.17 0 top
SV107  [MA05-2]  86.36,85.09 0 top
SV108  [MA05-2]  101.6,85.09 0 top
SV109  [MA05-2]  86.36,80.01 0 top
SV110  [MA05-2]  101.6,80.01 0 top
SV111  [MA05-2]  86.36,74.93 0 top
SV112  [MA05-2]  101.6,74.93 0 top
SV113  [MA05-2]  86.36,69.85 0 top
SV114  [MA05-2]  101.6,69.85 0 top
SV115  [MA05-2]  86.36,64.77 0 top
SV116  [MA05-2]  101.6,64.77 0 top
SV117  [MA05-2]  86.36,59.69 0 top
SV118  [MA05-2]  101.6,59.69 0 top
SV119  [MA05-2]  86.36,54.61 0 top
SV120  [MA05-2]  101.6,54.61 0 top
SV121  [MA05-2]  86.36,49.53 0 top
SV122  [MA05-2]  101.6,49.53 0 top
SV123  [MA05-2]  86.36,44.45 0 top
SV124  [MA05-2]  101.6,44.45 0 top
SV125  [MA20-1]  93.98,163.83 270 top
SV126  [MA05-2]  162.56,186.69 0 top
SV127  [MA08-1]  93.98,52.07 270 top
SV128  [MA05-2]  162.56,181.61 0 top
SV129  [MA10-1]  93.98,74.93 270 top
SV130  [MA05-2]  162.56,176.53 0 top
SV131  [MA20-1]  93.98,113.03 270 top
SV132  [MA05-2]  162.56,171.45 0 top
SV133  [MA05-2]  162.56,166.37 0 top
SV134  [MA05-2]  177.8,186.69 0 top
SV135  [MA05-2]  177.8,181.61 0 top
SV136  [MA05-2]  177.8,176.53 0 top
SV137  [MA05-2]  177.8,171.45 0 top
SV138  [MA05-2]  177.8,166.37 0 top
SV139  [MA05-2]  162.56,161.29 0 top
SV140  [MA05-2]  177.8,161.29 0 top
SV141  [MA05-2]  162.56,156.21 0 top
SV142  [MA05-2]  177.8,156.21 0 top
SV143  [MA05-2]  162.56,151.13 0 top
SV144  [MA05-2]  177.8,151.13 0 top
SV145  [MA05-2]  162.56,146.05 0 top
SV146  [MA05-2]  177.8,146.05 0 top
SV147  [MA05-2]  162.56,140.97 0 top
SV148  [MA05-2]  177.8,140.97 0 top
SV149  [MA05-2]  162.56,135.89 0 top
SV150  [MA05-2]  177.8,135.89 0 top
SV151  [MA05-2]  162.56,130.81 0 top
SV152  [MA05-2]  177.8,130.81 0 top
SV153  [MA05-2]  162.56,125.73 0 top
SV154  [MA05-2]  177.8,125.73 0 top
SV155  [MA05-2]  162.56,120.65 0 top
SV156  [MA05-2]  177.8,120.65 0 top
SV157  [MA05-2]  162.56,115.57 0 top
SV158  [MA05-2]  177.8,115.57 0 top
SV159  [MA05-2]  193.04,186.69 0 top
SV160  [MA05-2]  208.28,186.69 0 top
SV161  [MA05-2]  193.04,181.61 0 top
SV162  [MA05-2]  208.28,181.61 0 top
SV163  [MA05-2]  193.04,176.53 0 top
SV164  [MA05-2]  208.28,176.53 0 top
SV165  [MA05-2]  193.04,171.45 0 top
SV166  [MA05-2]  208.28,171.45 0 top
SV167  [MA05-2]  208.28,166.37 0 top
SV168  [MA05-2]  193.04,166.37 0 top
SV169  [MA05-2]  193.04,161.29 0 top
SV170  [MA05-2]  208.28,161.29 0 top
SV171  [MA05-2]  193.04,156.21 0 top
SV172  [MA05-2]  208.28,156.21 0 top
SV173  [MA05-2]  193.04,151.13 0 top
SV174  [MA05-2]  208.28,151.13 0 top
SV175  [MA20-1]  170.18,163.83 270 top
SV176  [MA20-1]  185.42,163.83 270 top
SV177  [MA08-1]  200.66,179.07 270 top
SV178  [MA08-1]  200.66,158.75 270 top
SV179  [MA10-1]  170.18,125.73 90 top
SV180  [MA10-1]  185.42,125.73 270 top
U$1  OUTLINE-OMNIBUS  [OMNIBUS]  0,0 0 top
U$2  [EDGE-CON8]  0,0 0 top
VCC1  [JP1]  19.05,191.77 90 top
VCC2  [JP1]  19.05,166.37 90 top
VCC3  [JP1]  19.05,140.97 90 top
VCC4  [JP1]  19.05,115.57 90 top
VCC5  [JP1]  19.05,90.17 90 top
VCC6  [JP1]  19.05,64.77 90 top
VCC7  [JP1]  19.05,39.37 90 top
VCC8  [JP1]  41.91,191.77 90 top
VCC9  [JP1]  41.91,166.37 90 top
VCC10  [JP1]  41.91,140.97 90 top
VCC11  [JP1]  41.91,115.57 90 top
VCC12  [JP1]  41.91,90.17 90 top
VCC13  [JP1]  41.91,64.77 90 top
VCC14  [JP1]  41.91,39.37 90 top
VCC15  [JP1]  67.31,191.77 90 top
VCC16  [JP1]  82.55,191.77 90 top
VCC17  [JP1]  97.79,191.77 90 top
VCC18  [JP1]  67.31,39.37 90 top
VCC19  [JP1]  82.55,39.37 90 top
VCC20  [JP1]  97.79,39.37 90 top
VCC21  [JP1]  125.73,191.77 90 top
VCC22  [JP1]  125.73,166.37 90 top
VCC23  [JP1]  125.73,140.97 90 top
VCC24  [JP1]  125.73,115.57 90 top
VCC25  [JP1]  125.73,90.17 90 top
VCC26  [JP1]  125.73,64.77 90 top
VCC27  [JP1]  125.73,39.37 90 top
VCC28  [JP1]  148.59,191.77 90 top
VCC29  [JP1]  148.59,166.37 90 top
VCC30  [JP1]  148.59,140.97 90 top
VCC31  [JP1]  148.59,90.17 90 top
VCC32  [JP1]  148.59,115.57 90 top
VCC33  [JP1]  148.59,64.77 90 top
VCC34  [JP1]  173.99,191.77 90 top
VCC35  [JP1]  173.99,110.49 90 top
VCC36  [JP1]  204.47,191.77 90 top
VCC37  [JP1]  204.47,146.05 90 top
VCC38  [JP1]  232.41,191.77 90 top
VCC39  [JP1]  232.41,166.37 90 top
VCC40  [JP1]  232.41,140.97 90 top
VCC41  [JP1]  255.27,166.37 90 top
VCC42  [JP1]  255.27,140.97 90 top
VCC43  [JP1]  255.27,115.57 90 top
VCC44  [JP1]  232.41,115.57 90 top

## Tracks (layer width: path | path; a pad name or v marks a point on that pad's centre or on a via)
!BREAK_CYCLE
  Bottom 0.406: D8.10 163.19,24.77 163.19,22.23 164.47,20.96 164.47,14.61 163.83,13.97 U$2.BL2
!BRK_DATA_CONT
  Bottom 0.406: D8.9 166.37,24.77 166.37,22.23 167.64,20.96 167.64,14.61 167,13.97 U$2.BK2
!BRK_IN_PROG
  Bottom 0.406: D8.5 178.44,24.77 177.16,23.5 177.16,14.61 177.8,13.97 U$2.BE2
!BUS_STROBE
  Top 0.406: D11.9 102.23,19.69 102.23,13.97 U$2.CK1
!C0
  Top 0.406: D11.5 114.94,19.69 114.94,13.97 U$2.CE1
!C1
  Top 0.406: D11.7 108.58,19.69 108.58,13.97 U$2.CH1
!C2
  Top 0.406: D11.8 105.41,19.69 105.41,13.97 U$2.CJ1
!CE
  Top 0.406: Q1.1 249.56,100.33 250.82,101.6 C2.1 256.54,99.7 259.08,97.16 259.08,85.09 210.19,85.09 208.91,83.82 IC3.20 207.65,83.82 206.38,82.55 179.71,82.55 178.44,83.82 IC4.20
  Bottom 0.406: C2.1 R7.1
!CPMA_DISABLE
  Top 0.406: D11.17 76.83,19.69 76.83,13.97 U$2.CU1
!D
  Bottom 0.406: D14.9 33.02,24.77 34.29,23.5 34.29,14.61 33.66,13.97 U$2.DK2
!DATA0
  Top 0.406: D9.14 219.71,19.69 219.71,13.97 U$2.AR1
!DATA1
  Top 0.406: D9.15 216.53,19.69 216.53,13.97 U$2.AS1
!DATA2
  Top 0.406: D9.17 210.19,19.69 210.19,13.97 U$2.AU1
!DATA3
  Top 0.406: D9.18 207.01,19.69 207.01,13.97 U$2.AV1
!DATA4
  Top 0.406: D7.14 149.86,19.69 149.86,13.97 U$2.BR1
!DATA5
  Top 0.406: D7.15 146.69,19.69 146.69,13.97 U$2.BS1
!DATA6
  Top 0.406: D7.17 140.34,19.69 140.34,13.97 U$2.BU1
!DATA7
  Top 0.406: D7.18 137.16,19.69 137.16,13.97 U$2.BV1
!DATA8
  Top 0.406: D13.14 16.51,19.69 16.51,13.97 U$2.DR1
!DATA9
  Top 0.406: D13.15 13.34,19.69 13.34,13.97 U$2.DS1
!DATA10
  Top 0.406: D13.17 6.99,19.69 6.99,13.97 U$2.DU1
!DATA11
  Top 0.406: D13.18 3.81,19.69 3.81,13.97 U$2.DV1
!E
  Bottom 0.406: D14.10 29.84,24.77 29.84,22.23 31.11,20.96 31.11,14.61 30.48,13.97 U$2.DL2
!EMA0  (via drill 0.81)
  Top 0.406: IC3.8 179.71,86.36 178.44,87.63 164.47,87.63 163.19,86.36 IC4.8 161.29,85.09 161.29,80.65 161.93,80.01 208.91,80.01 214.63,74.3 | 214.63,74.3 v223.52,65.41 | v251.46,41.91 251.46,75.57 248.92,75.57 247.01,77.47 229.24,77.47 224.16,82.55 222.88,82.55 214.63,74.3
  Bottom 0.406: U$2.AD2 252.73,13.97 253.37,14.61 253.37,23.5 252.09,24.77 D10.4 251.46,26.04 v251.46,41.91 | v223.52,65.41 IC5.1
!EMA1  (via drill 0.81)
  Top 0.406: IC4.9 174.62,83.82 175.9,85.09 178.44,85.09 179.71,83.82 IC3.9 193.68,83.82 194.94,85.09 v205.74,85.09 | v233.04,36.2 v227.33,36.2 | v248.92,30.48 v233.04,30.48 | v227.33,55.88 IC5.2 v219.71,55.88 | v219.71,63.5 v205.74,63.5
  Bottom 0.406: v227.33,36.2 v227.33,55.88 | v233.04,30.48 v233.04,36.2 | v248.92,30.48 248.92,26.04 D10.5 248.92,24.77 248.92,22.86 250.19,21.59 250.19,14.61 249.56,13.97 U$2.AE2 | v205.74,63.5 v205.74,85.09 | v219.71,55.88 v219.71,63.5
!EMA2  (via drill 0.81)
  Top 0.406: v214.63,53.34 IC5.3 | v242.57,31.75 208.28,31.75 v207.01,33.02 | IC4.10 163.19,81.28 164.47,82.55 178.44,82.55 179.71,81.28 IC3.10
  Bottom 0.406: U$2.AH2 243.21,13.97 243.84,14.61 243.84,20.96 242.57,22.23 242.57,24.77 D10.7 242.32,31.5 v242.57,31.75 | v214.63,53.34 214.63,40.64 v207.01,33.02 199.39,25.4 193.04,25.4 193.04,69.22 191.77,70.49 191.77,79.38 193.04,80.65 IC3.10
!F
  Bottom 0.406: D14.8 36.2,24.77 37.47,23.5 37.47,14.61 36.83,13.97 U$2.DJ2
!FSET
  Bottom 0.406: D14.13 19.68,24.77 18.41,23.5 18.41,14.61 19.05,13.97 U$2.DP2
!IND1
  Bottom 0.406: D12.17 77.47,24.77 78.74,23.5 78.74,14.61 78.11,13.97 U$2.CU2
!IND2
  Bottom 0.406: D12.18 74.3,24.77 75.56,23.5 75.56,14.61 74.93,13.97 U$2.CV2
!INT_RQST
  Top 0.406: D11.13 89.53,19.69 89.53,13.97 U$2.CP1
!INTERNAL_IO
  Top 0.406: D11.10 99.06,19.69 99.06,13.97 U$2.CL1
!IO_PAUSE
  Top 0.406: D11.4 118.11,19.69 118.11,13.97 U$2.CD1
!IR0
  Bottom 0.406: D14.4 48.26,24.77 46.99,23.5 46.99,14.61 47.62,13.97 U$2.DD2
!IR1
  Bottom 0.406: D14.5 45.09,24.77 43.81,23.5 43.81,14.61 44.45,13.97 U$2.DE2
!IR2
  Bottom 0.406: D14.7 39.37,24.77 40.64,23.5 40.64,14.61 40.01,13.97 U$2.DH2
!KEY_CONT
  Bottom 0.406: D14.17 7.62,24.77 8.89,23.5 8.89,14.61 8.26,13.97 U$2.DU2
!LA_ENABLE
  Bottom 0.406: D8.11 160.02,24.77 160.02,22.23 161.29,20.96 161.29,14.61 160.66,13.97 U$2.BM2
!LINK
  Bottom 0.406: D10.18 207.65,24.77 208.91,23.5 208.91,14.61 208.28,13.97 U$2.AV2
!LINK_DATA
  Bottom 0.406: D12.14 86.36,24.77 85.09,23.5 85.09,14.61 85.72,13.97 U$2.CR2
!LINK_LOAD
  Bottom 0.406: D12.15 83.19,24.77 81.92,23.5 81.92,14.61 82.55,13.97 U$2.CS2
!LOAD_CONT
  Bottom 0.406: D8.7 172.72,24.77 173.99,23.5 173.99,14.61 173.35,13.97 U$2.BH2
!MA00  (via drill 0.81)
  Top 0.406: IC4.21 178.44,86.36 179.71,85.09 193.68,85.09 194.94,86.36 IC3.21 | U$2.AD1 251.46,13.97 251.46,19.69 D9.4 252.09,20.96 252.73,21.59 262.89,21.59 262.89,99.7 257.18,105.41 255.91,105.41 250.82,110.49 235.59,110.49 v233.04,107.95
  Bottom 0.406: v233.04,107.95 233.04,92.71 207.65,92.71 207.01,92.08 207.01,88.27 208.28,87 IC3.21
!MA01  (via drill 0.81)
  Top 0.406: IC4.23 178.44,91.44 179.71,90.17 206.38,90.17 207.65,91.44 IC3.23 | U$2.AE1 248.28,13.97 248.28,19.69 D9.5 248.28,20.96 247.65,21.59 216.53,21.59 v215.26,22.86
  Bottom 0.406: v215.26,22.86 215.26,26.04 215.9,26.67 215.9,83.19 208.28,90.81 IC3.23
!MA02  (via drill 0.81)
  Top 0.406: IC4.24 178.44,93.98 179.71,92.71 206.38,92.71 207.65,93.98 IC3.24 208.91,93.98 212.72,90.17 v238.76,90.17 | D9.7 241.94,19.69 241.94,13.97 U$2.AH1
  Bottom 0.406: v238.76,90.17 240.66,88.27 240.66,22.23 241.94,20.96 D9.7
!MA03  (via drill 0.81)
  Top 0.406: IC4.25 178.44,96.52 179.71,95.25 206.38,95.25 207.65,96.52 IC3.25 208.91,96.52 214,91.44 v235.59,91.44 | D9.8 238.76,19.69 238.76,13.97 U$2.AJ1
  Bottom 0.406: v235.59,91.44 237.49,89.54 237.49,22.23 238.76,20.96 D9.8
!MA04  (via drill 0.81)
  Top 0.406: IC4.26 178.44,99.06 179.71,97.79 v187.96,97.79 205.1,97.79 206.38,99.06 IC3.26 | D7.4 181.61,19.69 181.61,13.97 U$2.BD1
  Bottom 0.406: v187.96,97.79 187.96,30.48 183.51,26.04 183.51,22.23 182.25,20.96 D7.4
!MA05
  Top 0.406: IC4.1 163.19,104.14 164.47,105.41 191.13,105.41 192.41,104.14 IC3.1 | D7.5 178.44,19.69 178.44,13.97 U$2.BE1
  Bottom 0.406: IC3.1 187.96,104.14 186.69,102.87 186.69,32.39 180.34,26.04 180.34,24.77 179.07,23.5 179.07,20.96 D7.5
!MA06
  Top 0.406: IC4.2 163.19,101.6 164.47,102.87 178.44,102.87 179.71,101.6 IC3.2 | D7.7 172.09,19.69 172.09,13.97 U$2.BH1
  Bottom 0.406: IC4.2 162.56,100.97 171.45,92.08 171.45,26.67 170.81,26.04 170.81,22.23 172.09,20.96 D7.7
!MA07
  Top 0.406: IC4.3 163.19,99.06 164.47,100.33 178.44,100.33 179.71,99.06 IC3.3 | D7.8 168.91,19.69 168.91,13.97 U$2.BJ1
  Bottom 0.406: IC4.3 162.56,98.43 168.91,92.08 168.91,27.31 167.64,26.04 167.64,22.23 168.91,20.96 D7.8
!MA08  (via drill 0.81)
  Top 0.406: IC3.4 179.71,96.52 178.44,97.79 164.47,97.79 163.19,96.52 IC4.4 160.02,93.98 160.02,66.04 128.91,34.93 v50.16,34.93 | D13.4 48.26,19.69 48.26,13.97 U$2.DD1
  Bottom 0.406: D13.4 48.64,20.7 50.16,22.23 v50.16,34.93
!MA09  (via drill 0.81)
  Top 0.406: IC4.5 163.19,93.98 164.47,95.25 178.44,95.25 179.71,93.98 IC3.5 | D13.5 45.09,19.69 45.09,13.97 U$2.DE1 | v156.21,64.77 156.21,63.5 128.91,36.2 v46.99,36.2
  Bottom 0.406: IC4.5 156.21,88.9 v156.21,64.77 | v46.99,36.2 46.99,24.77 45.72,23.5 45.72,20.96 D13.5
!MA10  (via drill 0.81)
  Top 0.406: IC4.6 163.19,91.44 164.47,92.71 178.44,92.71 179.71,91.44 IC3.6 | U$2.DH1 38.73,13.97 38.73,19.69 D13.7 39.37,20.96 40.01,21.59 v130.81,21.59
  Bottom 0.406: v130.81,21.59 149.86,40.64 149.86,45.72 151.13,46.99 153.67,46.99 157.48,51.44 157.48,86.36 IC4.6
!MA11  (via drill 0.81)
  Top 0.406: IC4.7 163.19,88.9 164.47,90.17 178.44,90.17 179.71,88.9 IC3.7 | U$2.DJ1 35.56,13.97 35.56,19.69 D13.8 36.2,20.96 37.47,22.23 37.47,26.04 40.01,28.58 136.53,28.58 137.16,29.21 140.34,29.21 v159.38,48.26
  Bottom 0.406: v159.38,48.26 159.38,85.09 162.56,88.27 IC4.7
!MD00  (via drill 0.81)
  Top 0.406: v220.98,59.69 197.49,59.69 196.85,60.33 195.58,60.33 IC1.2 | v234.31,34.93 v220.98,34.93 | U$2.AK1 236.22,13.97 236.22,19.69 D9.9
  Bottom 0.406: v220.98,34.93 v220.98,59.69 | v234.31,34.93 234.31,22.23 235.59,20.96 D9.9
!MD01  (via drill 0.81)
  Top 0.406: v231.78,38.74 232.41,38.74 232.41,48.9 231.78,49.53 230.5,49.53 227.97,52.07 202.56,52.07 196.22,58.42 IC1.3 | U$2.AL1 232.41,13.97 232.41,19.69 D9.10
  Bottom 0.406: v231.78,38.74 231.14,38.1 231.14,22.23 232.41,20.96 D9.10
!MD02  (via drill 0.81)
  Top 0.406: v224.79,29.21 201.93,29.21 201.93,46.36 196.22,52.07 194.31,52.07 194.31,53.98 195.58,55.25 IC1.4 | U$2.AM1 229.24,13.97 229.24,19.69 D9.11
  Bottom 0.406: v224.79,29.21 227.97,26.04 227.97,22.23 229.24,20.96 D9.11
!MD03  (via drill 0.81)
  Top 0.406: v217.17,46.99 202.56,46.99 196.22,53.34 IC1.5 | U$2.AP1 222.88,13.97 222.88,19.69 D9.13
  Bottom 0.406: v217.17,46.99 219.71,44.45 219.71,27.94 221.62,26.04 221.62,22.23 222.88,20.96 D9.13
!MD04  (via drill 0.81)
  Top 0.406: v167.64,29.21 199.39,29.21 199.39,46.36 195.58,50.17 IC1.6 | U$2.BK1 165.74,13.97 165.74,19.69 D7.9
  Bottom 0.406: v167.64,29.21 164.47,26.04 164.47,22.23 165.74,20.96 D7.9
!MD05  (via drill 0.81)
  Top 0.406: v167.64,32.39 196.85,32.39 196.85,46.36 195.58,47.63 IC1.7 | U$2.BL1 162.56,13.97 162.56,19.69 D7.10
  Bottom 0.406: v167.64,32.39 161.29,26.04 161.29,22.23 162.56,20.96 D7.10
!MD06  (via drill 0.81)
  Top 0.406: v167.64,36.83 173.35,36.83 180.97,44.45 193.68,44.45 194.94,45.72 IC1.8 | U$2.BM1 159.38,13.97 159.38,19.69 D7.11
  Bottom 0.406: v167.64,36.83 158.12,27.31 158.12,22.23 159.38,20.96 D7.11
!MD07  (via drill 0.81)
  Top 0.406: v162.56,33.66 171.45,33.66 179.71,41.91 193.68,41.91 194.94,43.18 IC1.9 | U$2.BP1 153.03,13.97 153.03,19.69 D7.13
  Bottom 0.406: v162.56,33.66 154.94,26.04 154.94,22.23 153.67,20.96 D7.13
!MD08  (via drill 0.81)
  Top 0.406: v37.47,32.39 128.91,32.39 157.48,60.96 IC2.2 | U$2.DK1 32.38,13.97 32.38,19.69 D13.9
  Bottom 0.406: v37.47,32.39 31.11,26.04 31.11,22.23 32.38,20.96 D13.9
!MD09  (via drill 0.81)
  Top 0.406: v33.02,31.12 128.91,31.12 151.13,53.34 161.93,53.34 167,58.42 IC2.3 | U$2.DL1 29.21,13.97 29.21,19.69 D13.10
  Bottom 0.406: v33.02,31.12 27.94,26.04 27.94,22.23 29.21,20.96 D13.10
!MD10
  Top 0.406: IC2.4 167,55.88 163.19,52.07 151.13,52.07 128.91,29.85 31.75,29.85 27.94,26.04 27.94,22.23 26.67,20.96 D13.11 26.04,19.69 26.04,13.97 U$2.DM1
!MD11
  Top 0.406: IC2.5 168.28,53.34 169.54,54.61 175.9,54.61 176.53,55.25 176.53,59.69 170.81,59.69 168.28,62.23 157.48,62.23 128.91,33.66 29.21,33.66 21.59,26.04 21.59,22.23 20.32,20.96 D13.13 19.68,19.69 19.68,13.97 U$2.DP1
!MD_DIR  (via drill 0.81)
  Top 0.406: v231.14,113.67 230.5,114.3 218.44,114.3 208.28,124.46 208.28,129.54 204.47,133.35 197.49,133.35 196.22,134.62 IC8.2
  Bottom 0.406: v231.14,113.67 234.31,110.49 234.31,86.36 235.59,85.09 235.59,26.04 D10.9 236.22,24.77 236.22,22.23 237.49,20.96 237.49,14.61 236.85,13.97 U$2.AK2
!MEM_START
  Bottom 0.406: D10.8 239.4,24.77 239.4,22.23 240.66,20.96 240.66,14.61 240.03,13.97 U$2.AJ2
!MS_DISABLE
  Top 0.406: D11.18 73.66,19.69 73.66,13.97 U$2.CV1
!NOT_LAST_TR
  Top 0.406: D11.11 95.89,19.69 95.89,13.97 U$2.CM1
!NTS_STALL
  Bottom 0.406: D8.14 149.86,24.77 148.59,23.5 148.59,14.61 149.22,13.97 U$2.BR2
!OVERFLOW
  Bottom 0.406: D8.8 169.54,24.77 169.54,22.23 170.81,20.96 170.81,14.61 170.18,13.97 U$2.BJ2
!READ_EN  (via drill 0.81)
  Top 0.406: IC2.1 168.28,63.5 169.54,64.77 v177.16,64.77 193.68,64.77 194.94,63.5 IC1.1 | IC4.22 178.44,88.9 179.71,87.63 206.38,87.63 207.65,88.9 IC3.22 240.03,88.9 240.03,90.81 238.12,92.71 233.04,92.71 231.78,93.98 IC7.8
  Bottom 0.406: v177.16,64.77 177.16,69.22 176.53,69.85 176.53,87 177.8,88.27 IC4.22
!ROM_ADDR  (via drill 0.81)
  Top 0.406: v214.63,36.2 223.52,45.09 IC5.6
  Bottom 0.406: v214.63,36.2 210.82,32.39 210.82,26.04 D10.17 210.82,24.77 212.09,23.5 212.09,14.61 211.46,13.97 U$2.AU2
!RUN
  Bottom 0.406: D8.17 140.97,24.77 142.24,23.5 142.24,14.61 141.6,13.97 U$2.BU2
!SKIP
  Top 0.406: D11.15 83.19,19.69 83.19,13.97 U$2.CS1
!STOP
  Bottom 0.406: D14.15 13.34,24.77 12.06,23.5 12.06,14.61 12.7,13.97 U$2.DS2
!TS1
  Bottom 0.406: D12.9 102.87,24.77 104.14,23.5 104.14,14.61 103.5,13.97 U$2.CK2
!TS2
  Bottom 0.406: D12.10 99.06,24.77 97.79,23.5 97.79,14.61 98.42,13.97 U$2.CL2
!TS3
  Bottom 0.406: D12.11 95.89,24.77 94.61,23.5 94.61,14.61 95.25,13.97 U$2.CM2
!TS4
  Bottom 0.406: D12.13 89.53,24.77 88.27,23.5 88.27,14.61 88.9,13.97 U$2.CP2
!USER_MODE
  Bottom 0.406: D14.11 26.04,24.77 24.77,23.5 24.77,14.61 25.4,13.97 U$2.DM2
!WRITE_EN
  Top 0.406: IC4.27 178.44,101.6 179.71,100.33 206.38,100.33 207.65,101.6 IC3.27
  Bottom 0.406: IC7.6 209.55,96.52 209.55,99.7 208.28,100.97 IC3.27
+15V
  Bottom 0.406: D14.1 57.78,24.77 56.52,23.5 56.52,14.61 57.15,13.97 U$2.DA2
-15V  (via drill 0.81)
  Top 0.813: D14.2 55.24,26.04 56.52,27.31 123.19,27.31 124.46,26.04 D12.2 125.09,26.04 126.36,27.31 137.16,27.31 137.79,27.94 187.96,27.94 | 187.96,27.94 187.96,26.04 D8.2 | v255.91,27.94 187.96,27.94
  Bottom 0.813: U$2.AB2 257.18,13.97 256.54,14.61 256.54,23.5 257.81,24.77 D10.2 257.81,26.04 v255.91,27.94 | D8.2 187.96,24.77 186.69,23.5 186.69,15.24 187.96,13.97 U$2.BB2 | D14.2 54.61,24.77 53.34,23.5 53.34,14.61 53.98,13.97 U$2.DB2 | D12.2 124.46,24.77 123.19,23.5 123.19,14.61 123.83,13.97 U$2.CB2
DISABLE  (via drill 0.81)
  Top 0.406: v205.74,96.52 207.01,97.79 Q1.3 254.63,97.79 255.91,96.52 C2.2
  Bottom 0.406: IC6.8 254,41.28 250.19,45.09 250.19,65.41 248.92,66.68 Q1.3 | v205.74,96.52 205.74,108.59 195.58,118.75 IC8.8
EMEM0
  Bottom 0.406: IC2.11 184.15,49.53 184.15,74.3 177.8,80.65 IC4.19
EMEM1
  Bottom 0.406: IC2.12 175.26,43.82 182.25,50.8 182.25,73.66 177.8,78.11 IC4.18
EMEM2
  Bottom 0.406: IC2.13 175.26,46.36 180.97,52.07 180.97,72.39 177.8,75.57 IC4.17
EMEM3
  Bottom 0.406: IC2.14 179.71,52.71 179.71,71.76 IC4.16
GND  (via drill 0.81)
  Top 0.813: GND20.1 GND20.2 | D11.12 92.71,19.69 92.71,13.97 U$2.CN2 | D13.6 41.91,19.69 41.91,13.97 U$2.DF1 | D13.3 51.44,19.69 51.44,13.97 U$2.DC1 | D11.16 80.01,19.69 80.01,13.97 U$2.CT2 | GND18.2 GND18.1 61.59,39.37 63.5,37.47 71.12,37.47 73.03,39.37 GND19.2 GND19.1 78.74,41.91 SV10.8 SV10.7 SV10.6 SV10.5 SV10.4 SV10.3 SV10.2 SV10.1 SV12.10 SV12.9 SV12.8 SV12.7 SV12.6 SV12.5 SV12.4 SV12.3 SV12.2 SV12.1 SV6.20 SV6.19 SV6.18 SV6.17 SV6.16 SV6.15 SV6.14 SV6.13 SV6.12 SV6.11 SV6.10 SV6.9 SV6.8 SV6.7 SV6.6 SV6.5 SV6.4 SV6.3 SV6.2 SV6.1 SV4.20 SV4.19 SV4.18 SV4.17 SV4.16 SV4.15 SV4.14 SV4.13 SV4.12 SV4.11 SV4.10 SV4.9 SV4.8 SV4.7 SV4.6 SV4.5 SV4.4 SV4.3 SV4.2 SV4.1 78.74,189.23 GND16.1 GND16.2 | D14.6 42.55,24.77 43.81,23.5 50.16,23.5 51.44,24.77 D14.3 | D9.3 254.63,19.69 254.63,13.97 U$2.AC1 | U$2.AF1 245.11,13.97 245.11,19.69 D9.6 | D10.3 254.63,24.77 253.37,23.5 247.01,23.5 245.75,24.77 D10.6 | U$2.AT2 213.36,13.97 213.36,19.69 D9.16 213.36,20.96 212.09,22.23 187.32,22.23 184.78,19.69 | 184.78,19.69 D7.3 | U$2.BC1 184.78,13.97 184.78,19.69 | D9.12 226.06,19.69 226.06,13.97 U$2.AN2 | IC4.14 163.19,71.12 165.1,69.22 v170.18,69.22 190.5,69.22 192.41,71.12 IC3.14 193.68,71.12 v195.58,69.22 | C4.2 198.12,65.41 202.56,60.96 IC1.19 C6.2 | 214,34.93 217.17,34.93 219.71,37.47 | 214,34.93 213.36,34.93 213.36,37.47 223.52,47.63 IC5.5 | 219.71,37.47 222.88,40.64 IC5.8 | 214,34.93 v214,33.66 | 219.71,37.47 242.57,37.47 245.75,40.64 IC6.7 | GND37.2 GND37.1 C9.2 IC8.1 SV180.1 | GND35.2 GND35.1 169.54,108.59 180.97,108.59 C1.2 185.42,109.22 SV180.10 | IC8.9 IC8.10 SV180.10